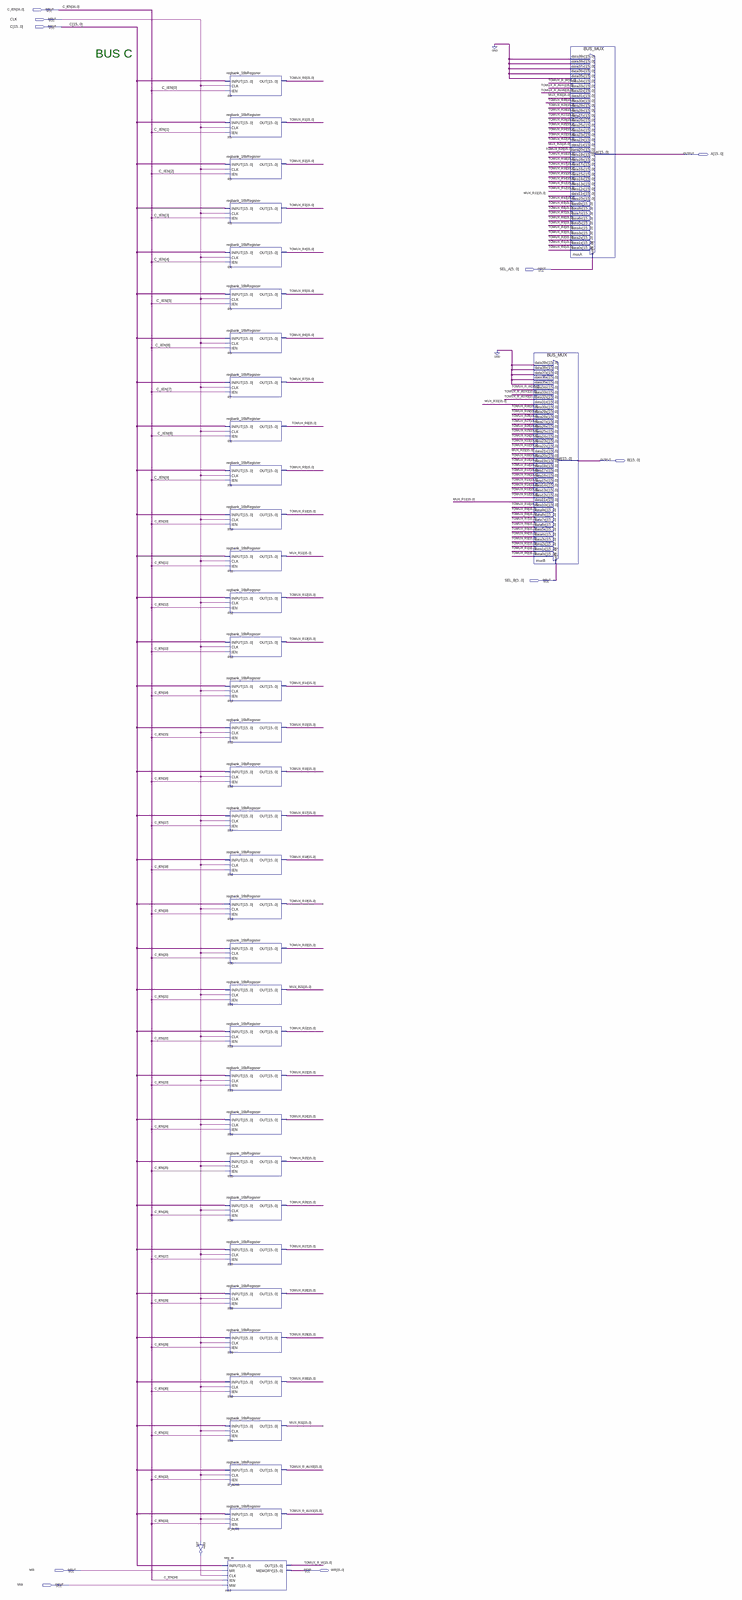
[diagram p0: schematic sheet, whole]
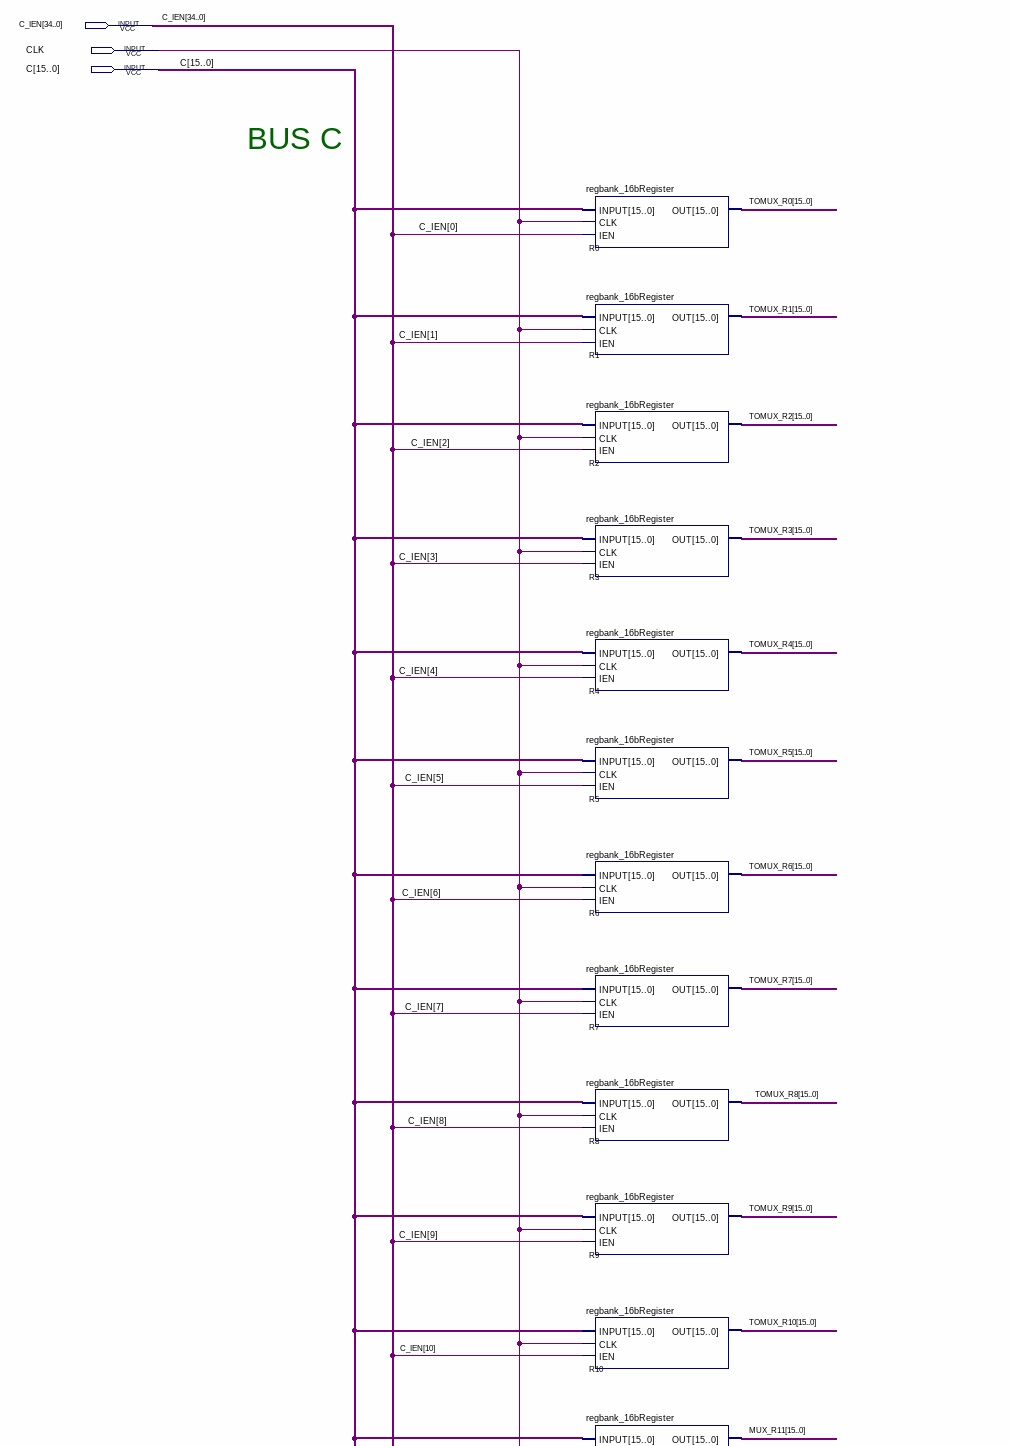
[diagram p1: schematic sheet, upper left part]
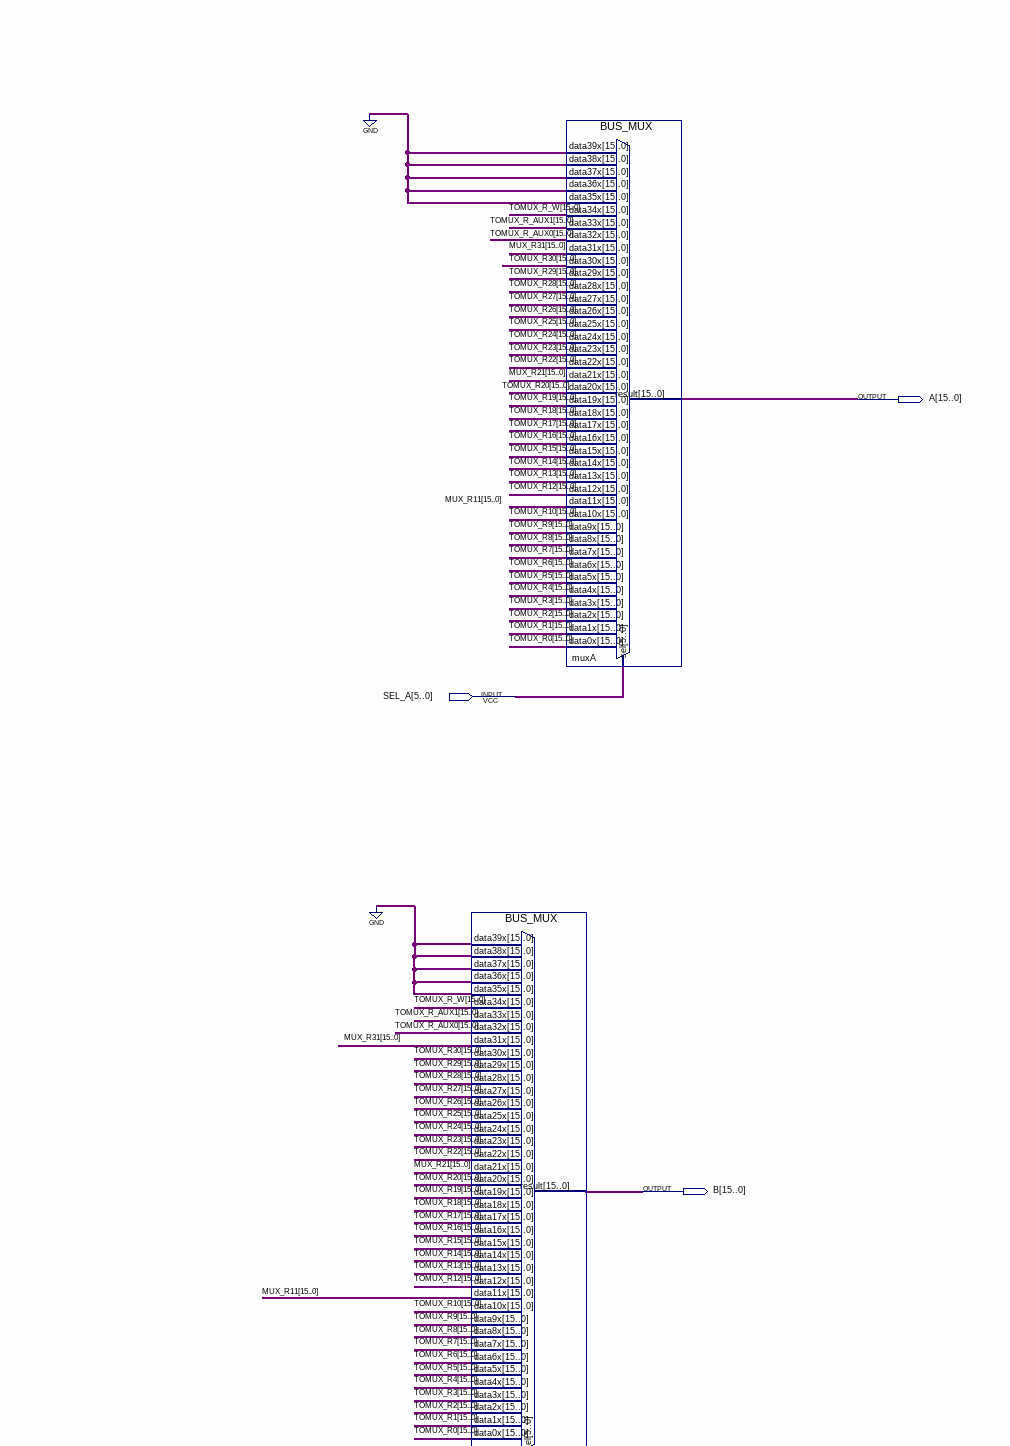
[diagram p2: schematic sheet, upper right part]
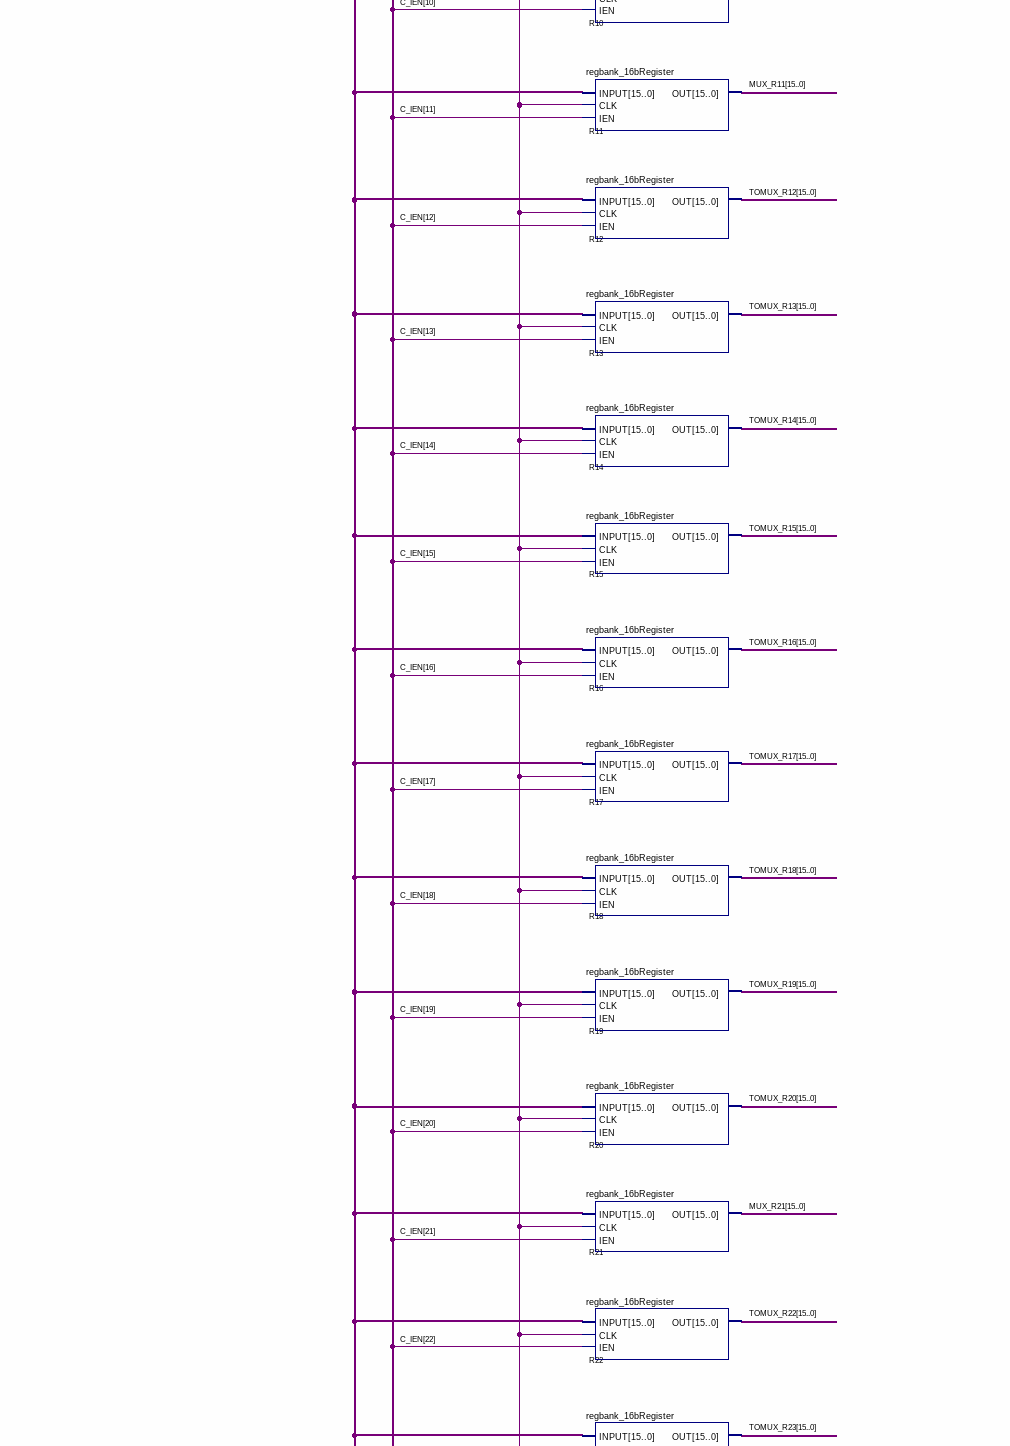
[diagram p3: schematic sheet, middle left part]
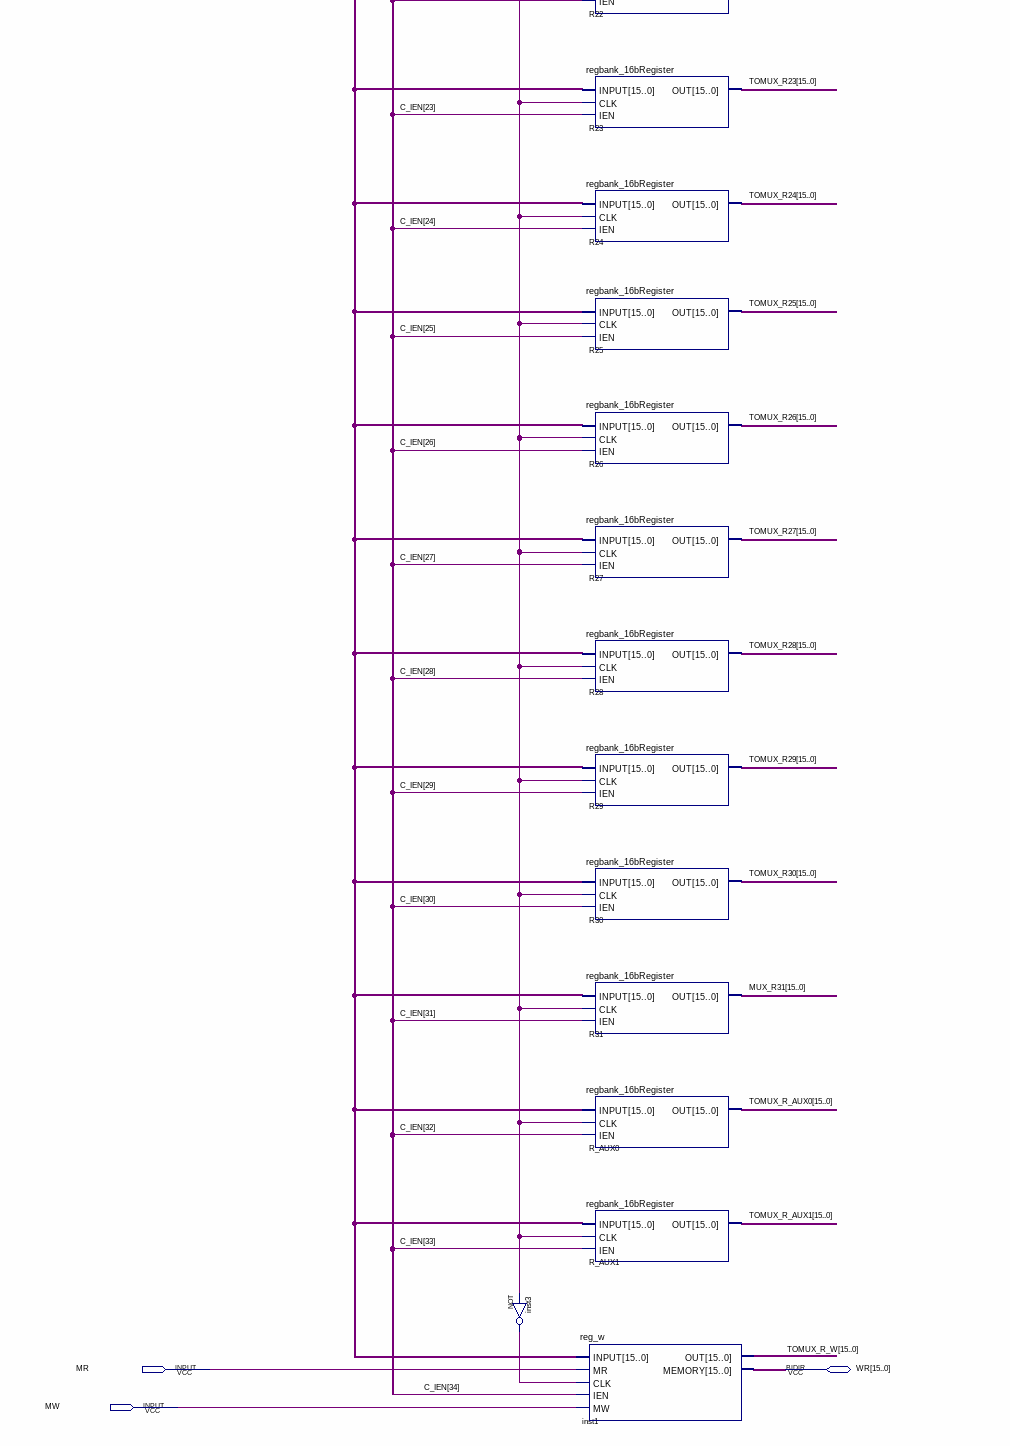
[diagram p4: schematic sheet, lower left part]
// Quartus schematic regbank_mainBlock.bdf as structural Verilog: 38 symbols, 10 pins
module regbank_mainBlock (
  input  [34:0] C_IEN,
  input  CLK,
  input  [15:0] C,
  input  [5:0] SEL_A,
  input  [5:0] SEL_B,
  input  MR,
  input  MW,
  inout  [15:0] WR,
  output [15:0] A,
  output [15:0] B
);

  wire inst3_out;
  wire [15:0] MUX_R11, MUX_R21, MUX_R31, TOMUX_R0, TOMUX_R1, TOMUX_R2, TOMUX_R3, TOMUX_R4, TOMUX_R5,
       TOMUX_R6, TOMUX_R7, TOMUX_R8, TOMUX_R9, TOMUX_R10, TOMUX_R12, TOMUX_R13, TOMUX_R14, TOMUX_R15,
       TOMUX_R16, TOMUX_R17, TOMUX_R18, TOMUX_R19, TOMUX_R20, TOMUX_R22, TOMUX_R23, TOMUX_R24, TOMUX_R25,
       TOMUX_R26, TOMUX_R27, TOMUX_R28, TOMUX_R29, TOMUX_R30, TOMUX_R_AUX0, TOMUX_R_AUX1, TOMUX_R_W;

  not inst3 (inst3_out, CLK);
  regbank_16bRegister R0 (.INPUT(C), .CLK(CLK), .IEN(C_IEN[0]), .OUT(TOMUX_R0));
  regbank_16bRegister R1 (.INPUT(C), .CLK(CLK), .IEN(C_IEN[1]), .OUT(TOMUX_R1));
  regbank_16bRegister R2 (.INPUT(C), .CLK(CLK), .IEN(C_IEN[2]), .OUT(TOMUX_R2));
  regbank_16bRegister R3 (.INPUT(C), .CLK(CLK), .IEN(C_IEN[3]), .OUT(TOMUX_R3));
  regbank_16bRegister R4 (.INPUT(C), .CLK(CLK), .IEN(C_IEN[4]), .OUT(TOMUX_R4));
  regbank_16bRegister R5 (.INPUT(C), .CLK(CLK), .IEN(C_IEN[5]), .OUT(TOMUX_R5));
  regbank_16bRegister R6 (.INPUT(C), .CLK(CLK), .IEN(C_IEN[6]), .OUT(TOMUX_R6));
  regbank_16bRegister R7 (.INPUT(C), .CLK(CLK), .IEN(C_IEN[7]), .OUT(TOMUX_R7));
  regbank_16bRegister R8 (.INPUT(C), .CLK(CLK), .IEN(C_IEN[8]), .OUT(TOMUX_R8));
  regbank_16bRegister R9 (.INPUT(C), .CLK(CLK), .IEN(C_IEN[9]), .OUT(TOMUX_R9));
  regbank_16bRegister R10 (.INPUT(C), .CLK(CLK), .IEN(C_IEN[10]), .OUT(TOMUX_R10));
  regbank_16bRegister R11 (.INPUT(C), .CLK(CLK), .IEN(C_IEN[11]), .OUT(MUX_R11));
  regbank_16bRegister R12 (.INPUT(C), .CLK(CLK), .IEN(C_IEN[12]), .OUT(TOMUX_R12));
  regbank_16bRegister R13 (.INPUT(C), .CLK(CLK), .IEN(C_IEN[13]), .OUT(TOMUX_R13));
  regbank_16bRegister R14 (.INPUT(C), .CLK(CLK), .IEN(C_IEN[14]), .OUT(TOMUX_R14));
  regbank_16bRegister R15 (.INPUT(C), .CLK(CLK), .IEN(C_IEN[15]), .OUT(TOMUX_R15));
  regbank_16bRegister R16 (.INPUT(C), .CLK(CLK), .IEN(C_IEN[16]), .OUT(TOMUX_R16));
  regbank_16bRegister R17 (.INPUT(C), .CLK(CLK), .IEN(C_IEN[17]), .OUT(TOMUX_R17));
  regbank_16bRegister R18 (.INPUT(C), .CLK(CLK), .IEN(C_IEN[18]), .OUT(TOMUX_R18));
  regbank_16bRegister R19 (.INPUT(C), .CLK(CLK), .IEN(C_IEN[19]), .OUT(TOMUX_R19));
  regbank_16bRegister R20 (.INPUT(C), .CLK(CLK), .IEN(C_IEN[20]), .OUT(TOMUX_R20));
  regbank_16bRegister R21 (.INPUT(C), .CLK(CLK), .IEN(C_IEN[21]), .OUT(MUX_R21));
  regbank_16bRegister R22 (.INPUT(C), .CLK(CLK), .IEN(C_IEN[22]), .OUT(TOMUX_R22));
  regbank_16bRegister R23 (.INPUT(C), .CLK(CLK), .IEN(C_IEN[23]), .OUT(TOMUX_R23));
  regbank_16bRegister R24 (.INPUT(C), .CLK(CLK), .IEN(C_IEN[24]), .OUT(TOMUX_R24));
  regbank_16bRegister R25 (.INPUT(C), .CLK(CLK), .IEN(C_IEN[25]), .OUT(TOMUX_R25));
  regbank_16bRegister R26 (.INPUT(C), .CLK(CLK), .IEN(C_IEN[26]), .OUT(TOMUX_R26));
  regbank_16bRegister R27 (.INPUT(C), .CLK(CLK), .IEN(C_IEN[27]), .OUT(TOMUX_R27));
  regbank_16bRegister R28 (.INPUT(C), .CLK(CLK), .IEN(C_IEN[28]), .OUT(TOMUX_R28));
  regbank_16bRegister R29 (.INPUT(C), .CLK(CLK), .IEN(C_IEN[29]), .OUT(TOMUX_R29));
  regbank_16bRegister R30 (.INPUT(C), .CLK(CLK), .IEN(C_IEN[30]), .OUT(TOMUX_R30));
  regbank_16bRegister R31 (.INPUT(C), .CLK(CLK), .IEN(C_IEN[31]), .OUT(MUX_R31));
  regbank_16bRegister R_AUX0 (.INPUT(C), .CLK(CLK), .IEN(C_IEN[32]), .OUT(TOMUX_R_AUX0));
  regbank_16bRegister R_AUX1 (.INPUT(C), .CLK(CLK), .IEN(C_IEN[33]), .OUT(TOMUX_R_AUX1));
  reg_w inst1 (.INPUT(C), .MR(MR), .CLK(inst3_out), .IEN(C_IEN[34]), .MW(MW), .OUT(TOMUX_R_W), .MEMORY(WR));
  BUS_MUX muxB (
    .data39x({16{1'b0}}), .data38x({16{1'b0}}), .data37x({16{1'b0}}), .data36x({16{1'b0}}),
    .data35x({16{1'b0}}), .data34x(TOMUX_R_W), .data33x(TOMUX_R_AUX1), .data32x(TOMUX_R_AUX0),
    .data31x(MUX_R31), .data30x(TOMUX_R30), .data29x(TOMUX_R29), .data28x(TOMUX_R28), .data27x(TOMUX_R27),
    .data26x(TOMUX_R26), .data25x(TOMUX_R25), .data24x(TOMUX_R24), .data23x(TOMUX_R23), .data22x(TOMUX_R22),
    .data21x(MUX_R21), .data20x(TOMUX_R20), .data19x(TOMUX_R19), .data18x(TOMUX_R18), .data17x(TOMUX_R17),
    .data16x(TOMUX_R16), .data15x(TOMUX_R15), .data14x(TOMUX_R14), .data13x(TOMUX_R13), .data12x(TOMUX_R12),
    .data11x(MUX_R11), .data10x(TOMUX_R10), .data9x(TOMUX_R9), .data8x(TOMUX_R8), .data7x(TOMUX_R7),
    .data6x(TOMUX_R6), .data5x(TOMUX_R5), .data4x(TOMUX_R4), .data3x(TOMUX_R3), .data2x(TOMUX_R2),
    .data1x(TOMUX_R1), .data0x(TOMUX_R0), .sel(SEL_B), .result(B));
  BUS_MUX muxA (
    .data39x({16{1'b0}}), .data38x({16{1'b0}}), .data37x({16{1'b0}}), .data36x({16{1'b0}}),
    .data35x({16{1'b0}}), .data34x(TOMUX_R_W), .data33x(TOMUX_R_AUX1), .data32x(TOMUX_R_AUX0),
    .data31x(MUX_R31), .data30x(TOMUX_R30), .data29x(TOMUX_R29), .data28x(TOMUX_R28), .data27x(TOMUX_R27),
    .data26x(TOMUX_R26), .data25x(TOMUX_R25), .data24x(TOMUX_R24), .data23x(TOMUX_R23), .data22x(TOMUX_R22),
    .data21x(MUX_R21), .data20x(TOMUX_R20), .data19x(TOMUX_R19), .data18x(TOMUX_R18), .data17x(TOMUX_R17),
    .data16x(TOMUX_R16), .data15x(TOMUX_R15), .data14x(TOMUX_R14), .data13x(TOMUX_R13), .data12x(TOMUX_R12),
    .data11x(MUX_R11), .data10x(TOMUX_R10), .data9x(TOMUX_R9), .data8x(TOMUX_R8), .data7x(TOMUX_R7),
    .data6x(TOMUX_R6), .data5x(TOMUX_R5), .data4x(TOMUX_R4), .data3x(TOMUX_R3), .data2x(TOMUX_R2),
    .data1x(TOMUX_R1), .data0x(TOMUX_R0), .sel(SEL_A), .result(A));

  // Notes on the sheet:
  //   BUS C  
endmodule
